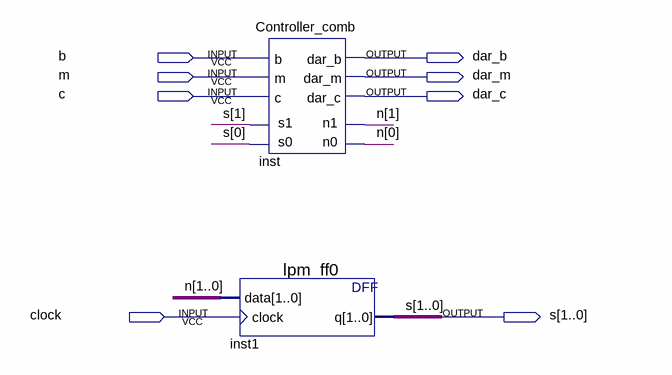
[diagram p0: schematic sheet]
// Quartus schematic Controller.bdf as structural Verilog: 2 symbols, 8 pins
module Controller (
  input  b,
  input  m,
  input  c,
  input  clock,
  output dar_b,
  output dar_m,
  output dar_c,
  output [1:0] s
);

  wire [1:0] n;

  lpm_ff0 inst1 (.data(n), .clock(clock), .q(s));
  Controller_comb inst (
    .s1(s[1]), .s0(s[0]), .b(b), .m(m), .c(c), .n1(n[1]), .n0(n[0]), .dar_b(dar_b), .dar_m(dar_m),
    .dar_c(dar_c));
endmodule
